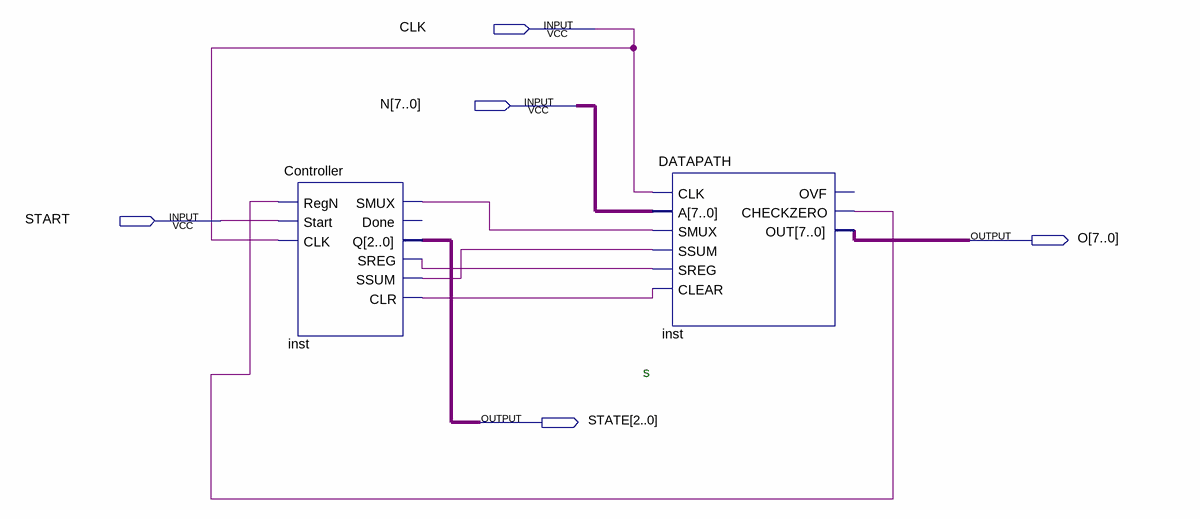
[diagram p0: schematic sheet]
// Quartus schematic lab4_5.bdf as structural Verilog: 2 symbols, 5 pins
module lab4_5 (
  input  CLK,
  input  [7:0] N,
  input  START,
  output [7:0] O,
  output [2:0] STATE
);

  wire inst_checkzero, inst_clr, inst_smux, inst_sreg, inst_ssum;

  Controller inst (
    .RegN(inst_checkzero), .Start(START), .CLK(CLK), .SMUX(inst_smux), .Q(STATE), .SREG(inst_sreg),
    .SSUM(inst_ssum), .CLR(inst_clr));  // open: Done
  DATAPATH inst_dup2 (
    .CLK(CLK), .A(N), .SMUX(inst_smux), .SSUM(inst_ssum), .SREG(inst_sreg), .CLEAR(inst_clr),
    .CHECKZERO(inst_checkzero), .OUT(O));  // open: OVF

  // Notes on the sheet:
  //   s
endmodule
